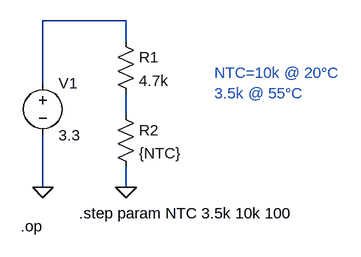
[diagram p0: schematic NTC-voltRange.asc]
NTC-voltRange.asc, the LTspice schematic file:
Version 4
SHEET 1 880 680
WIRE 48 0 -80 0
WIRE 48 32 48 0
WIRE -80 96 -80 0
WIRE 48 144 48 112
WIRE -80 256 -80 176
WIRE 48 256 48 224
FLAG 48 256 0
FLAG -80 256 0
SYMBOL res 32 16 R0
SYMATTR InstName R1
SYMATTR Value 4.7k
SYMBOL res 32 128 R0
SYMATTR InstName R2
SYMATTR Value {NTC}
SYMBOL voltage -80 80 R0
WINDOW 123 0 0 Left 0
WINDOW 39 0 0 Left 0
SYMATTR InstName V1
SYMATTR Value 3.3
TEXT -24 296 Left 2 !.step param NTC 3.5k 10k 100
TEXT -114 316 Left 2 !.op
TEXT 184 80 Left 2 ;NTC=10k @ 20°C\n3.5k @ 55°C

The netlist it stands for:
* NTC-voltRange.asc
R1 N001 N002 4.7k
R2 N002 0 {NTC}
V1 N001 0 3.3
.step param NTC 3.5k 10k 100
.op
* NTC=10k @ 20°C
* 3.5k @ 55°C
.backanno
.end